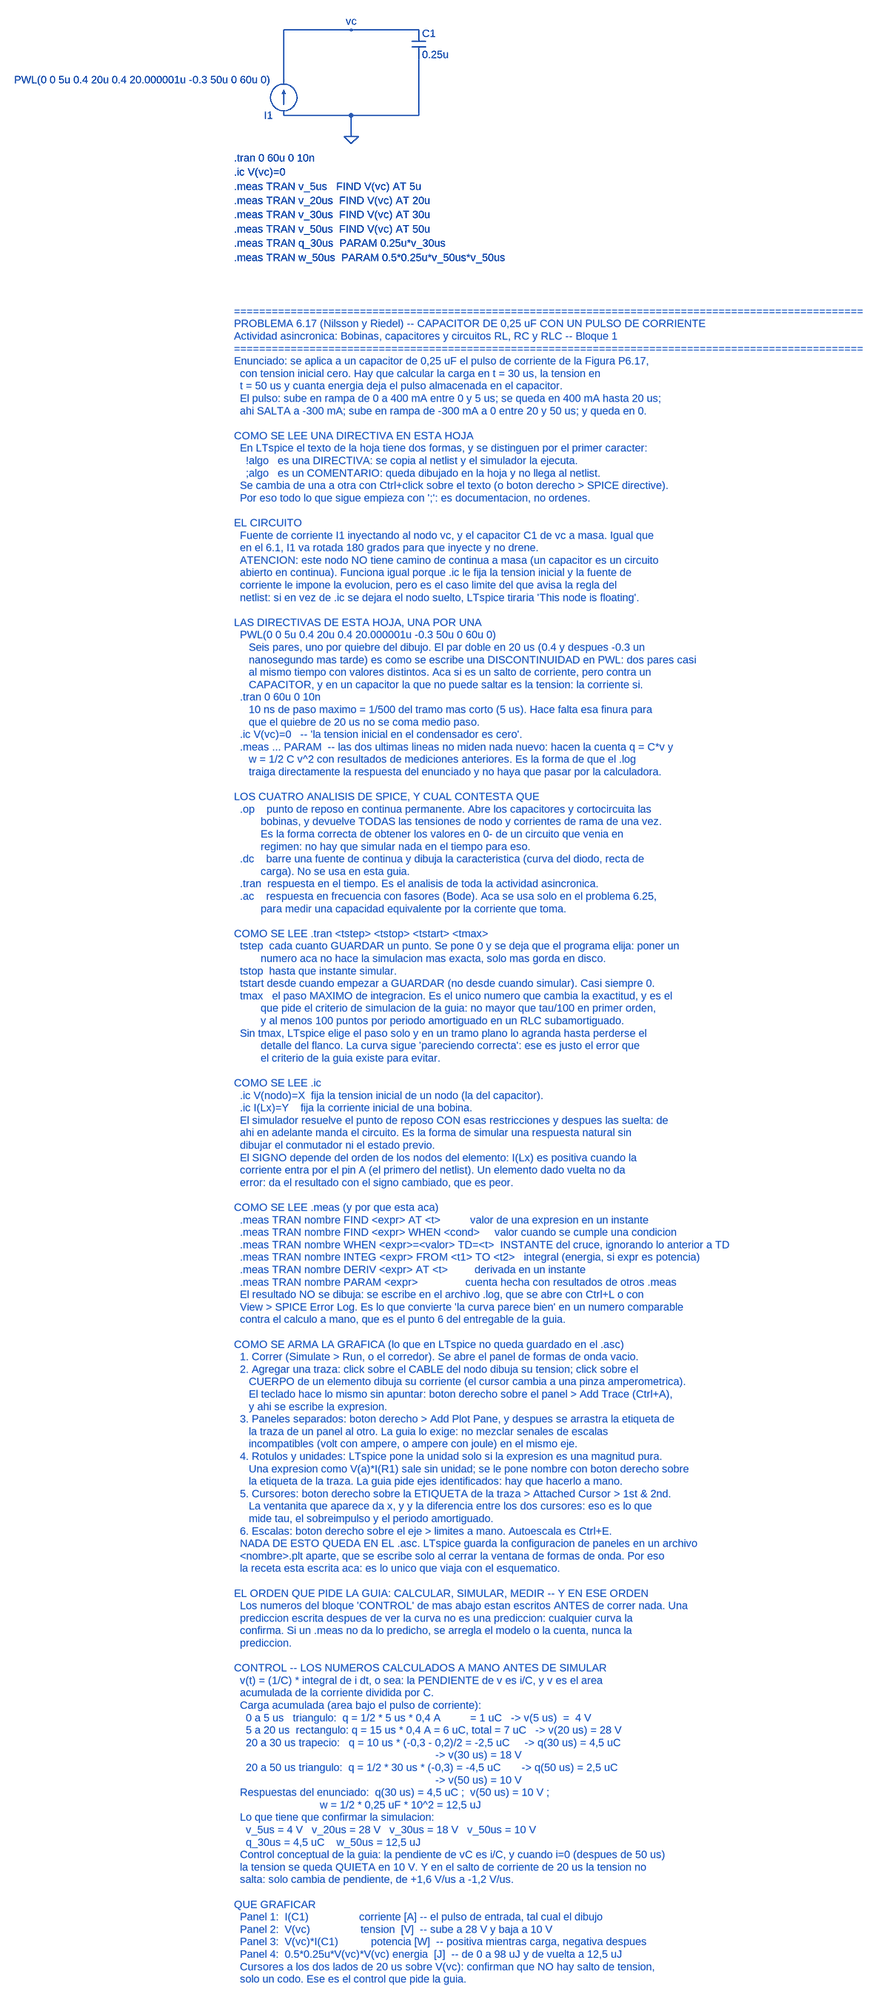
[diagram p0: schematic P6-17_capacitor_pulso_corriente.asc]
P6-17_capacitor_pulso_corriente.asc, the LTspice schematic file:
Version 4
SHEET 1 2000 2600
WIRE 176 224 176 112
WIRE 176 112 480 112
WIRE 480 176 480 304
WIRE 176 304 480 304
WIRE 328 304 328 352
FLAG 328 352 0
FLAG 328 112 vc
SYMBOL current 176 304 R180
WINDOW 123 0 0 Left 0
WINDOW 39 0 0 Left 0
SYMATTR InstName I1
SYMATTR Value PWL(0 0 5u 0.4 20u 0.4 20.000001u -0.3 50u 0 60u 0)
SYMBOL cap 464 112 R0
SYMATTR InstName C1
SYMATTR Value 0.25u
TEXT 64 400 Left 2 !.tran 0 60u 0 10n
TEXT 64 432 Left 2 !.ic V(vc)=0
TEXT 64 464 Left 2 !.meas TRAN v_5us   FIND V(vc) AT 5u
TEXT 64 496 Left 2 !.meas TRAN v_20us  FIND V(vc) AT 20u
TEXT 64 528 Left 2 !.meas TRAN v_30us  FIND V(vc) AT 30u
TEXT 64 560 Left 2 !.meas TRAN v_50us  FIND V(vc) AT 50u
TEXT 64 592 Left 2 !.meas TRAN q_30us  PARAM 0.25u*v_30us
TEXT 64 624 Left 2 !.meas TRAN w_50us  PARAM 0.5*0.25u*v_50us*v_50us
TEXT 64 900 Left 2 ;====================================================================================================
TEXT 64 928 Left 2 ;PROBLEMA 6.17 (Nilsson y Riedel) -- CAPACITOR DE 0,25 uF CON UN PULSO DE CORRIENTE
TEXT 64 956 Left 2 ;Actividad asincronica: Bobinas, capacitores y circuitos RL, RC y RLC -- Bloque 1
TEXT 64 984 Left 2 ;====================================================================================================
TEXT 64 1012 Left 2 ;Enunciado: se aplica a un capacitor de 0,25 uF el pulso de corriente de la Figura P6.17,
TEXT 64 1040 Left 2 ;  con tension inicial cero. Hay que calcular la carga en t = 30 us, la tension en
TEXT 64 1068 Left 2 ;  t = 50 us y cuanta energia deja el pulso almacenada en el capacitor.
TEXT 64 1096 Left 2 ;  El pulso: sube en rampa de 0 a 400 mA entre 0 y 5 us; se queda en 400 mA hasta 20 us;
TEXT 64 1124 Left 2 ;  ahi SALTA a -300 mA; sube en rampa de -300 mA a 0 entre 20 y 50 us; y queda en 0.
TEXT 64 1152 Left 2 ;
TEXT 64 1180 Left 2 ;COMO SE LEE UNA DIRECTIVA EN ESTA HOJA
TEXT 64 1208 Left 2 ;  En LTspice el texto de la hoja tiene dos formas, y se distinguen por el primer caracter:
TEXT 64 1236 Left 2 ;    !algo   es una DIRECTIVA: se copia al netlist y el simulador la ejecuta.
TEXT 64 1264 Left 2 ;    ;algo   es un COMENTARIO: queda dibujado en la hoja y no llega al netlist.
TEXT 64 1292 Left 2 ;  Se cambia de una a otra con Ctrl+click sobre el texto (o boton derecho > SPICE directive).
TEXT 64 1320 Left 2 ;  Por eso todo lo que sigue empieza con ';': es documentacion, no ordenes.
TEXT 64 1348 Left 2 ;
TEXT 64 1376 Left 2 ;EL CIRCUITO
TEXT 64 1404 Left 2 ;  Fuente de corriente I1 inyectando al nodo vc, y el capacitor C1 de vc a masa. Igual que
TEXT 64 1432 Left 2 ;  en el 6.1, I1 va rotada 180 grados para que inyecte y no drene.
TEXT 64 1460 Left 2 ;  ATENCION: este nodo NO tiene camino de continua a masa (un capacitor es un circuito
TEXT 64 1488 Left 2 ;  abierto en continua). Funciona igual porque .ic le fija la tension inicial y la fuente de
TEXT 64 1516 Left 2 ;  corriente le impone la evolucion, pero es el caso limite del que avisa la regla del
TEXT 64 1544 Left 2 ;  netlist: si en vez de .ic se dejara el nodo suelto, LTspice tiraria 'This node is floating'.
TEXT 64 1572 Left 2 ;
TEXT 64 1600 Left 2 ;LAS DIRECTIVAS DE ESTA HOJA, UNA POR UNA
TEXT 64 1628 Left 2 ;  PWL(0 0 5u 0.4 20u 0.4 20.000001u -0.3 50u 0 60u 0)
TEXT 64 1656 Left 2 ;     Seis pares, uno por quiebre del dibujo. El par doble en 20 us (0.4 y despues -0.3 un
TEXT 64 1684 Left 2 ;     nanosegundo mas tarde) es como se escribe una DISCONTINUIDAD en PWL: dos pares casi
TEXT 64 1712 Left 2 ;     al mismo tiempo con valores distintos. Aca si es un salto de corriente, pero contra un
TEXT 64 1740 Left 2 ;     CAPACITOR, y en un capacitor la que no puede saltar es la tension: la corriente si.
TEXT 64 1768 Left 2 ;  .tran 0 60u 0 10n
TEXT 64 1796 Left 2 ;     10 ns de paso maximo = 1/500 del tramo mas corto (5 us). Hace falta esa finura para
TEXT 64 1824 Left 2 ;     que el quiebre de 20 us no se coma medio paso.
TEXT 64 1852 Left 2 ;  .ic V(vc)=0   -- 'la tension inicial en el condensador es cero'.
TEXT 64 1880 Left 2 ;  .meas ... PARAM  -- las dos ultimas lineas no miden nada nuevo: hacen la cuenta q = C*v y
TEXT 64 1908 Left 2 ;     w = 1/2 C v^2 con resultados de mediciones anteriores. Es la forma de que el .log
TEXT 64 1936 Left 2 ;     traiga directamente la respuesta del enunciado y no haya que pasar por la calculadora.
TEXT 64 1964 Left 2 ;
TEXT 64 1992 Left 2 ;LOS CUATRO ANALISIS DE SPICE, Y CUAL CONTESTA QUE
TEXT 64 2020 Left 2 ;  .op    punto de reposo en continua permanente. Abre los capacitores y cortocircuita las
TEXT 64 2048 Left 2 ;         bobinas, y devuelve TODAS las tensiones de nodo y corrientes de rama de una vez.
TEXT 64 2076 Left 2 ;         Es la forma correcta de obtener los valores en 0- de un circuito que venia en
TEXT 64 2104 Left 2 ;         regimen: no hay que simular nada en el tiempo para eso.
TEXT 64 2132 Left 2 ;  .dc    barre una fuente de continua y dibuja la caracteristica (curva del diodo, recta de
TEXT 64 2160 Left 2 ;         carga). No se usa en esta guia.
TEXT 64 2188 Left 2 ;  .tran  respuesta en el tiempo. Es el analisis de toda la actividad asincronica.
TEXT 64 2216 Left 2 ;  .ac    respuesta en frecuencia con fasores (Bode). Aca se usa solo en el problema 6.25,
TEXT 64 2244 Left 2 ;         para medir una capacidad equivalente por la corriente que toma.
TEXT 64 2272 Left 2 ;
TEXT 64 2300 Left 2 ;COMO SE LEE .tran <tstep> <tstop> <tstart> <tmax>
TEXT 64 2328 Left 2 ;  tstep  cada cuanto GUARDAR un punto. Se pone 0 y se deja que el programa elija: poner un
TEXT 64 2356 Left 2 ;         numero aca no hace la simulacion mas exacta, solo mas gorda en disco.
TEXT 64 2384 Left 2 ;  tstop  hasta que instante simular.
TEXT 64 2412 Left 2 ;  tstart desde cuando empezar a GUARDAR (no desde cuando simular). Casi siempre 0.
TEXT 64 2440 Left 2 ;  tmax   el paso MAXIMO de integracion. Es el unico numero que cambia la exactitud, y es el
TEXT 64 2468 Left 2 ;         que pide el criterio de simulacion de la guia: no mayor que tau/100 en primer orden,
TEXT 64 2496 Left 2 ;         y al menos 100 puntos por periodo amortiguado en un RLC subamortiguado.
TEXT 64 2524 Left 2 ;  Sin tmax, LTspice elige el paso solo y en un tramo plano lo agranda hasta perderse el
TEXT 64 2552 Left 2 ;         detalle del flanco. La curva sigue 'pareciendo correcta': ese es justo el error que
TEXT 64 2580 Left 2 ;         el criterio de la guia existe para evitar.
TEXT 64 2608 Left 2 ;
TEXT 64 2636 Left 2 ;COMO SE LEE .ic
TEXT 64 2664 Left 2 ;  .ic V(nodo)=X  fija la tension inicial de un nodo (la del capacitor).
TEXT 64 2692 Left 2 ;  .ic I(Lx)=Y    fija la corriente inicial de una bobina.
TEXT 64 2720 Left 2 ;  El simulador resuelve el punto de reposo CON esas restricciones y despues las suelta: de
TEXT 64 2748 Left 2 ;  ahi en adelante manda el circuito. Es la forma de simular una respuesta natural sin
TEXT 64 2776 Left 2 ;  dibujar el conmutador ni el estado previo.
TEXT 64 2804 Left 2 ;  El SIGNO depende del orden de los nodos del elemento: I(Lx) es positiva cuando la
TEXT 64 2832 Left 2 ;  corriente entra por el pin A (el primero del netlist). Un elemento dado vuelta no da
TEXT 64 2860 Left 2 ;  error: da el resultado con el signo cambiado, que es peor.
TEXT 64 2888 Left 2 ;
TEXT 64 2916 Left 2 ;COMO SE LEE .meas (y por que esta aca)
TEXT 64 2944 Left 2 ;  .meas TRAN nombre FIND <expr> AT <t>          valor de una expresion en un instante
TEXT 64 2972 Left 2 ;  .meas TRAN nombre FIND <expr> WHEN <cond>     valor cuando se cumple una condicion
TEXT 64 3000 Left 2 ;  .meas TRAN nombre WHEN <expr>=<valor> TD=<t>  INSTANTE del cruce, ignorando lo anterior a TD
TEXT 64 3028 Left 2 ;  .meas TRAN nombre INTEG <expr> FROM <t1> TO <t2>   integral (energia, si expr es potencia)
TEXT 64 3056 Left 2 ;  .meas TRAN nombre DERIV <expr> AT <t>         derivada en un instante
TEXT 64 3084 Left 2 ;  .meas TRAN nombre PARAM <expr>                cuenta hecha con resultados de otros .meas
TEXT 64 3112 Left 2 ;  El resultado NO se dibuja: se escribe en el archivo .log, que se abre con Ctrl+L o con
TEXT 64 3140 Left 2 ;  View > SPICE Error Log. Es lo que convierte 'la curva parece bien' en un numero comparable
TEXT 64 3168 Left 2 ;  contra el calculo a mano, que es el punto 6 del entregable de la guia.
TEXT 64 3196 Left 2 ;
TEXT 64 3224 Left 2 ;COMO SE ARMA LA GRAFICA (lo que en LTspice no queda guardado en el .asc)
TEXT 64 3252 Left 2 ;  1. Correr (Simulate > Run, o el corredor). Se abre el panel de formas de onda vacio.
TEXT 64 3280 Left 2 ;  2. Agregar una traza: click sobre el CABLE del nodo dibuja su tension; click sobre el
TEXT 64 3308 Left 2 ;     CUERPO de un elemento dibuja su corriente (el cursor cambia a una pinza amperometrica).
TEXT 64 3336 Left 2 ;     El teclado hace lo mismo sin apuntar: boton derecho sobre el panel > Add Trace (Ctrl+A),
TEXT 64 3364 Left 2 ;     y ahi se escribe la expresion.
TEXT 64 3392 Left 2 ;  3. Paneles separados: boton derecho > Add Plot Pane, y despues se arrastra la etiqueta de
TEXT 64 3420 Left 2 ;     la traza de un panel al otro. La guia lo exige: no mezclar senales de escalas
TEXT 64 3448 Left 2 ;     incompatibles (volt con ampere, o ampere con joule) en el mismo eje.
TEXT 64 3476 Left 2 ;  4. Rotulos y unidades: LTspice pone la unidad solo si la expresion es una magnitud pura.
TEXT 64 3504 Left 2 ;     Una expresion como V(a)*I(R1) sale sin unidad; se le pone nombre con boton derecho sobre
TEXT 64 3532 Left 2 ;     la etiqueta de la traza. La guia pide ejes identificados: hay que hacerlo a mano.
TEXT 64 3560 Left 2 ;  5. Cursores: boton derecho sobre la ETIQUETA de la traza > Attached Cursor > 1st & 2nd.
TEXT 64 3588 Left 2 ;     La ventanita que aparece da x, y y la diferencia entre los dos cursores: eso es lo que
TEXT 64 3616 Left 2 ;     mide tau, el sobreimpulso y el periodo amortiguado.
TEXT 64 3644 Left 2 ;  6. Escalas: boton derecho sobre el eje > limites a mano. Autoescala es Ctrl+E.
TEXT 64 3672 Left 2 ;  NADA DE ESTO QUEDA EN EL .asc. LTspice guarda la configuracion de paneles en un archivo
TEXT 64 3700 Left 2 ;  <nombre>.plt aparte, que se escribe solo al cerrar la ventana de formas de onda. Por eso
TEXT 64 3728 Left 2 ;  la receta esta escrita aca: es lo unico que viaja con el esquematico.
TEXT 64 3756 Left 2 ;
TEXT 64 3784 Left 2 ;EL ORDEN QUE PIDE LA GUIA: CALCULAR, SIMULAR, MEDIR -- Y EN ESE ORDEN
TEXT 64 3812 Left 2 ;  Los numeros del bloque 'CONTROL' de mas abajo estan escritos ANTES de correr nada. Una
TEXT 64 3840 Left 2 ;  prediccion escrita despues de ver la curva no es una prediccion: cualquier curva la
TEXT 64 3868 Left 2 ;  confirma. Si un .meas no da lo predicho, se arregla el modelo o la cuenta, nunca la
TEXT 64 3896 Left 2 ;  prediccion.
TEXT 64 3924 Left 2 ;
TEXT 64 3952 Left 2 ;CONTROL -- LOS NUMEROS CALCULADOS A MANO ANTES DE SIMULAR
TEXT 64 3980 Left 2 ;  v(t) = (1/C) * integral de i dt, o sea: la PENDIENTE de v es i/C, y v es el area
TEXT 64 4008 Left 2 ;  acumulada de la corriente dividida por C.
TEXT 64 4036 Left 2 ;  Carga acumulada (area bajo el pulso de corriente):
TEXT 64 4064 Left 2 ;    0 a 5 us   triangulo:  q = 1/2 * 5 us * 0,4 A          = 1 uC   -> v(5 us)  =  4 V
TEXT 64 4092 Left 2 ;    5 a 20 us  rectangulo: q = 15 us * 0,4 A = 6 uC, total = 7 uC   -> v(20 us) = 28 V
TEXT 64 4120 Left 2 ;    20 a 30 us trapecio:   q = 10 us * (-0,3 - 0,2)/2 = -2,5 uC     -> q(30 us) = 4,5 uC
TEXT 64 4148 Left 2 ;                                                                    -> v(30 us) = 18 V
TEXT 64 4176 Left 2 ;    20 a 50 us triangulo:  q = 1/2 * 30 us * (-0,3) = -4,5 uC       -> q(50 us) = 2,5 uC
TEXT 64 4204 Left 2 ;                                                                    -> v(50 us) = 10 V
TEXT 64 4232 Left 2 ;  Respuestas del enunciado:  q(30 us) = 4,5 uC ;  v(50 us) = 10 V ;
TEXT 64 4260 Left 2 ;                             w = 1/2 * 0,25 uF * 10^2 = 12,5 uJ
TEXT 64 4288 Left 2 ;  Lo que tiene que confirmar la simulacion:
TEXT 64 4316 Left 2 ;    v_5us = 4 V   v_20us = 28 V   v_30us = 18 V   v_50us = 10 V
TEXT 64 4344 Left 2 ;    q_30us = 4,5 uC    w_50us = 12,5 uJ
TEXT 64 4372 Left 2 ;  Control conceptual de la guia: la pendiente de vC es i/C, y cuando i=0 (despues de 50 us)
TEXT 64 4400 Left 2 ;  la tension se queda QUIETA en 10 V. Y en el salto de corriente de 20 us la tension no
TEXT 64 4428 Left 2 ;  salta: solo cambia de pendiente, de +1,6 V/us a -1,2 V/us.
TEXT 64 4456 Left 2 ;
TEXT 64 4484 Left 2 ;QUE GRAFICAR
TEXT 64 4512 Left 2 ;  Panel 1:  I(C1)                 corriente [A] -- el pulso de entrada, tal cual el dibujo
TEXT 64 4540 Left 2 ;  Panel 2:  V(vc)                 tension  [V]  -- sube a 28 V y baja a 10 V
TEXT 64 4568 Left 2 ;  Panel 3:  V(vc)*I(C1)           potencia [W]  -- positiva mientras carga, negativa despues
TEXT 64 4596 Left 2 ;  Panel 4:  0.5*0.25u*V(vc)*V(vc) energia  [J]  -- de 0 a 98 uJ y de vuelta a 12,5 uJ
TEXT 64 4624 Left 2 ;  Cursores a los dos lados de 20 us sobre V(vc): confirman que NO hay salto de tension,
TEXT 64 4652 Left 2 ;  solo un codo. Ese es el control que pide la guia.

The netlist it stands for:
* P6-17_capacitor_pulso_corriente.asc
I1 0 vc PWL(0 0 5u 0.4 20u 0.4 20.000001u -0.3 50u 0 60u 0)
C1 vc 0 0.25u
.tran 0 60u 0 10n
.ic V(vc)=0
.meas TRAN v_5us   FIND V(vc) AT 5u
.meas TRAN v_20us  FIND V(vc) AT 20u
.meas TRAN v_30us  FIND V(vc) AT 30u
.meas TRAN v_50us  FIND V(vc) AT 50u
.meas TRAN q_30us  PARAM 0.25u*v_30us
.meas TRAN w_50us  PARAM 0.5*0.25u*v_50us*v_50us
* ====================================================================================================
* PROBLEMA 6.17 (Nilsson y Riedel) -- CAPACITOR DE 0,25 uF CON UN PULSO DE CORRIENTE
* Actividad asincronica: Bobinas, capacitores y circuitos RL, RC y RLC -- Bloque 1
* ====================================================================================================
* Enunciado: se aplica a un capacitor de 0,25 uF el pulso de corriente de la Figura P6.17,
*   con tension inicial cero. Hay que calcular la carga en t = 30 us, la tension en
*   t = 50 us y cuanta energia deja el pulso almacenada en el capacitor.
*   El pulso: sube en rampa de 0 a 400 mA entre 0 y 5 us; se queda en 400 mA hasta 20 us;
*   ahi SALTA a -300 mA; sube en rampa de -300 mA a 0 entre 20 y 50 us; y queda en 0.
* COMO SE LEE UNA DIRECTIVA EN ESTA HOJA
*   En LTspice el texto de la hoja tiene dos formas, y se distinguen por el primer caracter:
*     !algo   es una DIRECTIVA: se copia al netlist y el simulador la ejecuta.
*     ;algo   es un COMENTARIO: queda dibujado en la hoja y no llega al netlist.
*   Se cambia de una a otra con Ctrl+click sobre el texto (o boton derecho > SPICE directive).
*   Por eso todo lo que sigue empieza con ';': es documentacion, no ordenes.
* EL CIRCUITO
*   Fuente de corriente I1 inyectando al nodo vc, y el capacitor C1 de vc a masa. Igual que
*   en el 6.1, I1 va rotada 180 grados para que inyecte y no drene.
*   ATENCION: este nodo NO tiene camino de continua a masa (un capacitor es un circuito
*   abierto en continua). Funciona igual porque .ic le fija la tension inicial y la fuente de
*   corriente le impone la evolucion, pero es el caso limite del que avisa la regla del
*   netlist: si en vez de .ic se dejara el nodo suelto, LTspice tiraria 'This node is floating'.
* LAS DIRECTIVAS DE ESTA HOJA, UNA POR UNA
*   PWL(0 0 5u 0.4 20u 0.4 20.000001u -0.3 50u 0 60u 0)
*      Seis pares, uno por quiebre del dibujo. El par doble en 20 us (0.4 y despues -0.3 un
*      nanosegundo mas tarde) es como se escribe una DISCONTINUIDAD en PWL: dos pares casi
*      al mismo tiempo con valores distintos. Aca si es un salto de corriente, pero contra un
*      CAPACITOR, y en un capacitor la que no puede saltar es la tension: la corriente si.
*   .tran 0 60u 0 10n
*      10 ns de paso maximo = 1/500 del tramo mas corto (5 us). Hace falta esa finura para
*      que el quiebre de 20 us no se coma medio paso.
*   .ic V(vc)=0   -- 'la tension inicial en el condensador es cero'.
*   .meas ... PARAM  -- las dos ultimas lineas no miden nada nuevo: hacen la cuenta q = C*v y
*      w = 1/2 C v^2 con resultados de mediciones anteriores. Es la forma de que el .log
*      traiga directamente la respuesta del enunciado y no haya que pasar por la calculadora.
* LOS CUATRO ANALISIS DE SPICE, Y CUAL CONTESTA QUE
*   .op    punto de reposo en continua permanente. Abre los capacitores y cortocircuita las
*          bobinas, y devuelve TODAS las tensiones de nodo y corrientes de rama de una vez.
*          Es la forma correcta de obtener los valores en 0- de un circuito que venia en
*          regimen: no hay que simular nada en el tiempo para eso.
*   .dc    barre una fuente de continua y dibuja la caracteristica (curva del diodo, recta de
*          carga). No se usa en esta guia.
*   .tran  respuesta en el tiempo. Es el analisis de toda la actividad asincronica.
*   .ac    respuesta en frecuencia con fasores (Bode). Aca se usa solo en el problema 6.25,
*          para medir una capacidad equivalente por la corriente que toma.
* COMO SE LEE .tran <tstep> <tstop> <tstart> <tmax>
*   tstep  cada cuanto GUARDAR un punto. Se pone 0 y se deja que el programa elija: poner un
*          numero aca no hace la simulacion mas exacta, solo mas gorda en disco.
*   tstop  hasta que instante simular.
*   tstart desde cuando empezar a GUARDAR (no desde cuando simular). Casi siempre 0.
*   tmax   el paso MAXIMO de integracion. Es el unico numero que cambia la exactitud, y es el
*          que pide el criterio de simulacion de la guia: no mayor que tau/100 en primer orden,
*          y al menos 100 puntos por periodo amortiguado en un RLC subamortiguado.
*   Sin tmax, LTspice elige el paso solo y en un tramo plano lo agranda hasta perderse el
*          detalle del flanco. La curva sigue 'pareciendo correcta': ese es justo el error que
*          el criterio de la guia existe para evitar.
* COMO SE LEE .ic
*   .ic V(nodo)=X  fija la tension inicial de un nodo (la del capacitor).
*   .ic I(Lx)=Y    fija la corriente inicial de una bobina.
*   El simulador resuelve el punto de reposo CON esas restricciones y despues las suelta: de
*   ahi en adelante manda el circuito. Es la forma de simular una respuesta natural sin
*   dibujar el conmutador ni el estado previo.
*   El SIGNO depende del orden de los nodos del elemento: I(Lx) es positiva cuando la
*   corriente entra por el pin A (el primero del netlist). Un elemento dado vuelta no da
*   error: da el resultado con el signo cambiado, que es peor.
* COMO SE LEE .meas (y por que esta aca)
*   .meas TRAN nombre FIND <expr> AT <t>          valor de una expresion en un instante
*   .meas TRAN nombre FIND <expr> WHEN <cond>     valor cuando se cumple una condicion
*   .meas TRAN nombre WHEN <expr>=<valor> TD=<t>  INSTANTE del cruce, ignorando lo anterior a TD
*   .meas TRAN nombre INTEG <expr> FROM <t1> TO <t2>   integral (energia, si expr es potencia)
*   .meas TRAN nombre DERIV <expr> AT <t>         derivada en un instante
*   .meas TRAN nombre PARAM <expr>                cuenta hecha con resultados de otros .meas
*   El resultado NO se dibuja: se escribe en el archivo .log, que se abre con Ctrl+L o con
*   View > SPICE Error Log. Es lo que convierte 'la curva parece bien' en un numero comparable
*   contra el calculo a mano, que es el punto 6 del entregable de la guia.
* COMO SE ARMA LA GRAFICA (lo que en LTspice no queda guardado en el .asc)
*   1. Correr (Simulate > Run, o el corredor). Se abre el panel de formas de onda vacio.
*   2. Agregar una traza: click sobre el CABLE del nodo dibuja su tension; click sobre el
*      CUERPO de un elemento dibuja su corriente (el cursor cambia a una pinza amperometrica).
*      El teclado hace lo mismo sin apuntar: boton derecho sobre el panel > Add Trace (Ctrl+A),
*      y ahi se escribe la expresion.
*   3. Paneles separados: boton derecho > Add Plot Pane, y despues se arrastra la etiqueta de
*      la traza de un panel al otro. La guia lo exige: no mezclar senales de escalas
*      incompatibles (volt con ampere, o ampere con joule) en el mismo eje.
*   4. Rotulos y unidades: LTspice pone la unidad solo si la expresion es una magnitud pura.
*      Una expresion como V(a)*I(R1) sale sin unidad; se le pone nombre con boton derecho sobre
*      la etiqueta de la traza. La guia pide ejes identificados: hay que hacerlo a mano.
*   5. Cursores: boton derecho sobre la ETIQUETA de la traza > Attached Cursor > 1st & 2nd.
*      La ventanita que aparece da x, y y la diferencia entre los dos cursores: eso es lo que
*      mide tau, el sobreimpulso y el periodo amortiguado.
*   6. Escalas: boton derecho sobre el eje > limites a mano. Autoescala es Ctrl+E.
*   NADA DE ESTO QUEDA EN EL .asc. LTspice guarda la configuracion de paneles en un archivo
*   <nombre>.plt aparte, que se escribe solo al cerrar la ventana de formas de onda. Por eso
*   la receta esta escrita aca: es lo unico que viaja con el esquematico.
* EL ORDEN QUE PIDE LA GUIA: CALCULAR, SIMULAR, MEDIR -- Y EN ESE ORDEN
*   Los numeros del bloque 'CONTROL' de mas abajo estan escritos ANTES de correr nada. Una
*   prediccion escrita despues de ver la curva no es una prediccion: cualquier curva la
*   confirma. Si un .meas no da lo predicho, se arregla el modelo o la cuenta, nunca la
*   prediccion.
* CONTROL -- LOS NUMEROS CALCULADOS A MANO ANTES DE SIMULAR
*   v(t) = (1/C) * integral de i dt, o sea: la PENDIENTE de v es i/C, y v es el area
*   acumulada de la corriente dividida por C.
*   Carga acumulada (area bajo el pulso de corriente):
*     0 a 5 us   triangulo:  q = 1/2 * 5 us * 0,4 A          = 1 uC   -> v(5 us)  =  4 V
*     5 a 20 us  rectangulo: q = 15 us * 0,4 A = 6 uC, total = 7 uC   -> v(20 us) = 28 V
*     20 a 30 us trapecio:   q = 10 us * (-0,3 - 0,2)/2 = -2,5 uC     -> q(30 us) = 4,5 uC
*                                                                     -> v(30 us) = 18 V
*     20 a 50 us triangulo:  q = 1/2 * 30 us * (-0,3) = -4,5 uC       -> q(50 us) = 2,5 uC
*                                                                     -> v(50 us) = 10 V
*   Respuestas del enunciado:  q(30 us) = 4,5 uC ;  v(50 us) = 10 V ;
*                              w = 1/2 * 0,25 uF * 10^2 = 12,5 uJ
*   Lo que tiene que confirmar la simulacion:
*     v_5us = 4 V   v_20us = 28 V   v_30us = 18 V   v_50us = 10 V
*     q_30us = 4,5 uC    w_50us = 12,5 uJ
*   Control conceptual de la guia: la pendiente de vC es i/C, y cuando i=0 (despues de 50 us)
*   la tension se queda QUIETA en 10 V. Y en el salto de corriente de 20 us la tension no
*   salta: solo cambia de pendiente, de +1,6 V/us a -1,2 V/us.
* QUE GRAFICAR
*   Panel 1:  I(C1)                 corriente [A] -- el pulso de entrada, tal cual el dibujo
*   Panel 2:  V(vc)                 tension  [V]  -- sube a 28 V y baja a 10 V
*   Panel 3:  V(vc)*I(C1)           potencia [W]  -- positiva mientras carga, negativa despues
*   Panel 4:  0.5*0.25u*V(vc)*V(vc) energia  [J]  -- de 0 a 98 uJ y de vuelta a 12,5 uJ
*   Cursores a los dos lados de 20 us sobre V(vc): confirman que NO hay salto de tension,
*   solo un codo. Ese es el control que pide la guia.
.backanno
.end